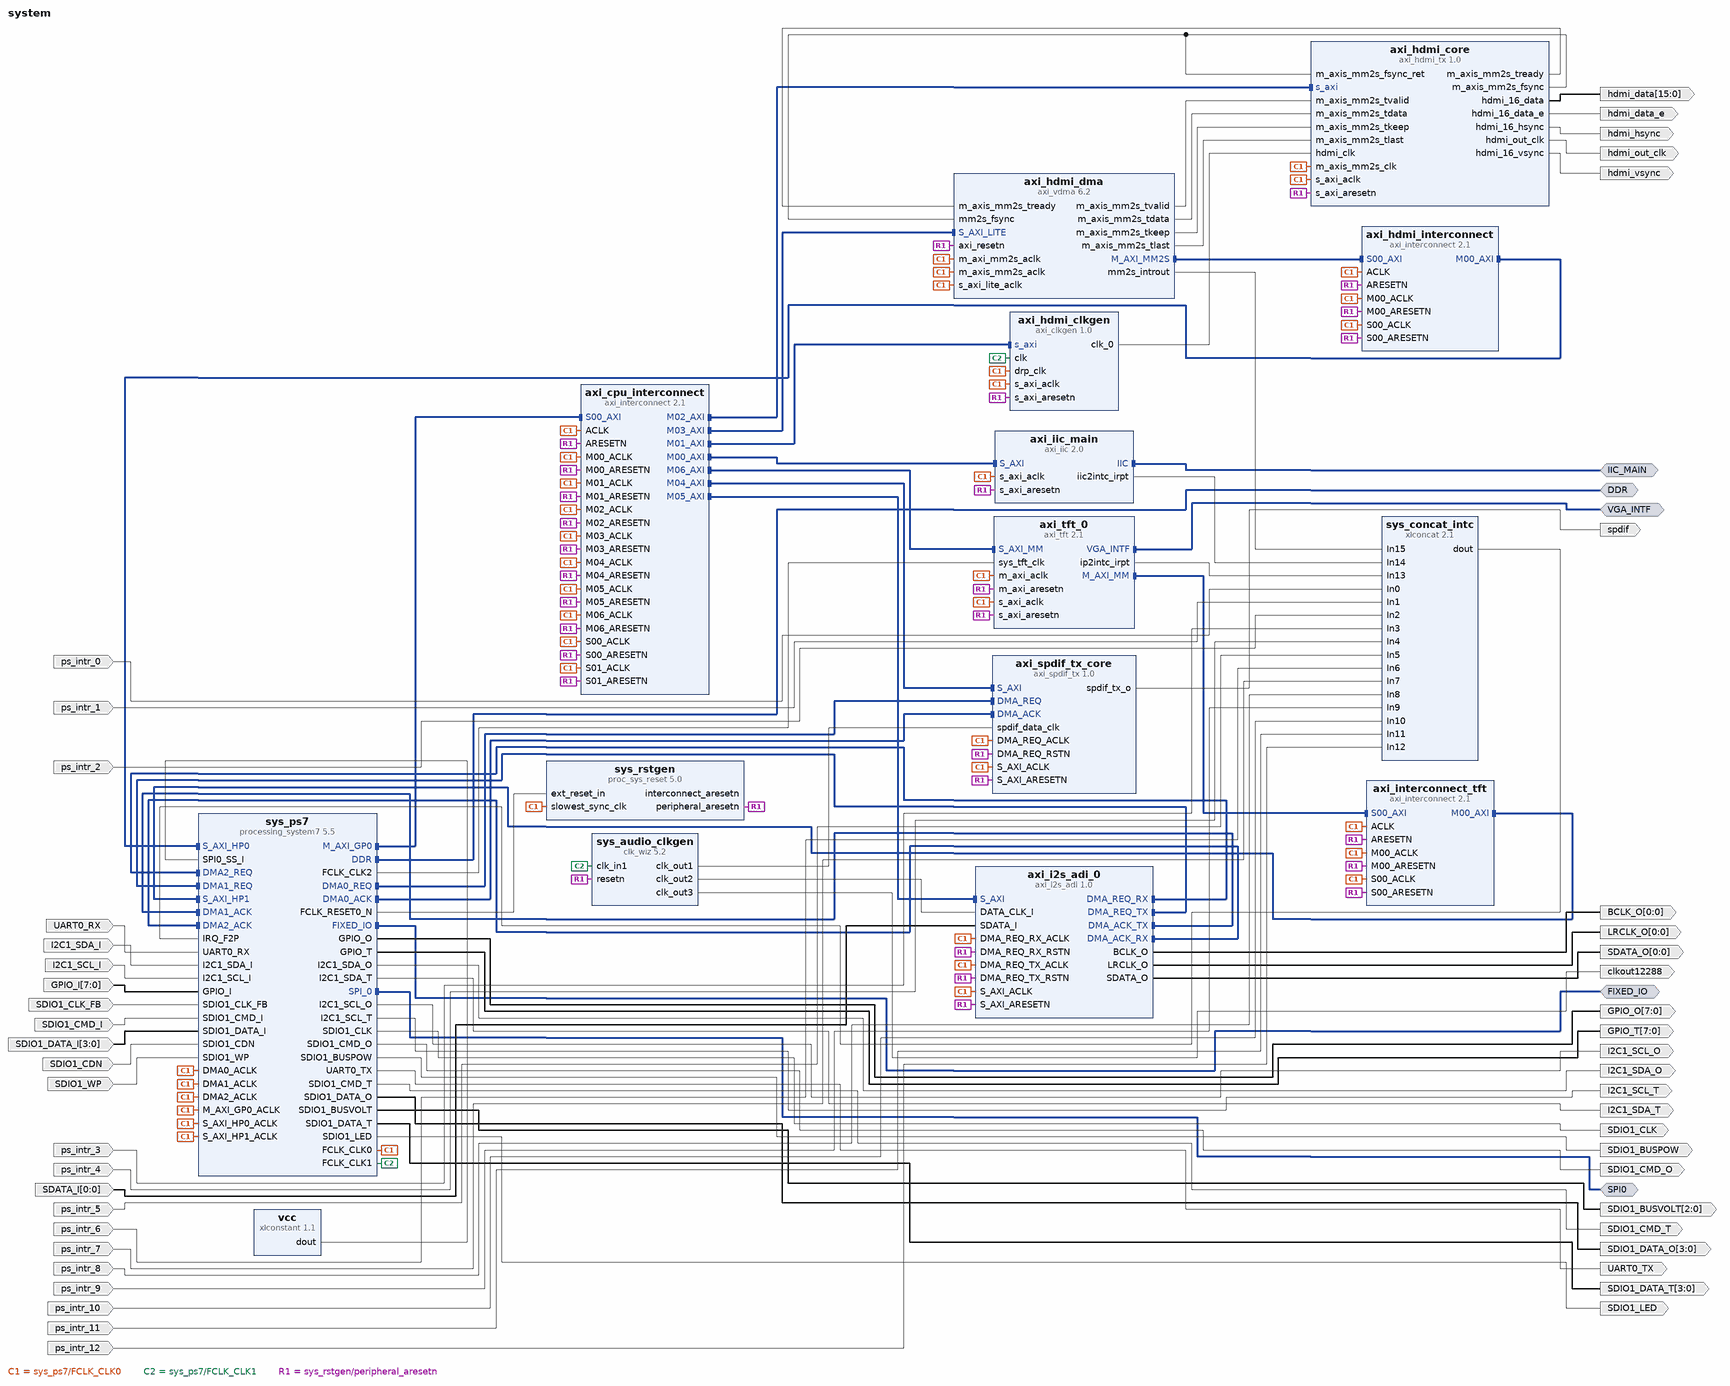
[diagram p0: block diagram of the top level]
# Vivado block design system, Vivado 2015.4
create_bd_design system

create_bd_intf_port -mode Master -vlnv xilinx.com:interface:ddrx_rtl:1.0 DDR
create_bd_intf_port -mode Master -vlnv xilinx.com:display_processing_system7:fixedio_rtl:1.0 FIXED_IO
create_bd_intf_port -mode Master -vlnv xilinx.com:interface:iic_rtl:1.0 IIC_MAIN
create_bd_intf_port -mode Master -vlnv xilinx.com:interface:spi_rtl:1.0 SPI0
create_bd_intf_port -mode Master -vlnv xilinx.com:interface:vga_rtl:1.0 VGA_INTF
create_bd_port -dir O -from 7 -to 0 GPIO_O
create_bd_port -dir O -from 7 -to 0 GPIO_T
create_bd_port -dir O hdmi_out_clk
create_bd_port -dir O hdmi_hsync
create_bd_port -dir O hdmi_vsync
create_bd_port -dir O hdmi_data_e
create_bd_port -dir O -from 15 -to 0 hdmi_data
create_bd_port -dir O spdif
create_bd_port -dir I ps_intr_0
create_bd_port -dir I ps_intr_1
create_bd_port -dir I ps_intr_2
create_bd_port -dir I ps_intr_3
create_bd_port -dir I ps_intr_4
create_bd_port -dir I ps_intr_5
create_bd_port -dir I ps_intr_6
create_bd_port -dir I ps_intr_7
create_bd_port -dir I ps_intr_8
create_bd_port -dir I ps_intr_9
create_bd_port -dir I ps_intr_10
create_bd_port -dir I ps_intr_11
create_bd_port -dir I ps_intr_12
create_bd_port -dir O -from 0 -to 0 SDATA_O
create_bd_port -dir O -from 0 -to 0 LRCLK_O
create_bd_port -dir O -from 0 -to 0 BCLK_O
create_bd_port -dir O UART0_TX
create_bd_port -dir I UART0_RX
create_bd_port -dir I I2C1_SDA_I
create_bd_port -dir O I2C1_SDA_O
create_bd_port -dir O I2C1_SDA_T
create_bd_port -dir I I2C1_SCL_I
create_bd_port -dir O I2C1_SCL_O
create_bd_port -dir O I2C1_SCL_T
create_bd_port -dir O -type clk clkout12288
create_bd_port -dir I -from 7 -to 0 GPIO_I
create_bd_port -dir I -from 0 -to 0 SDATA_I
create_bd_port -dir O SDIO1_CLK
create_bd_port -dir I SDIO1_CLK_FB
create_bd_port -dir O SDIO1_CMD_O
create_bd_port -dir I SDIO1_CMD_I
create_bd_port -dir O SDIO1_CMD_T
create_bd_port -dir I -from 3 -to 0 SDIO1_DATA_I
create_bd_port -dir O -from 3 -to 0 SDIO1_DATA_O
create_bd_port -dir O -from 3 -to 0 SDIO1_DATA_T
create_bd_port -dir I SDIO1_CDN
create_bd_port -dir I SDIO1_WP
create_bd_port -dir O SDIO1_BUSPOW
create_bd_port -dir O -from 2 -to 0 SDIO1_BUSVOLT
create_bd_port -dir O SDIO1_LED

create_bd_cell -type ip -vlnv analog.com:user:axi_clkgen:1.0 axi_hdmi_clkgen
create_bd_cell -type ip -vlnv analog.com:user:axi_hdmi_tx:1.0 axi_hdmi_core
create_bd_cell -type ip -vlnv analog.com:user:axi_spdif_tx:1.0 axi_spdif_tx_core
set_property -dict {CONFIG.C_S_AXI_ADDR_WIDTH 16 CONFIG.C_DMA_TYPE 1} [get_bd_cells axi_spdif_tx_core]
create_bd_cell -type ip -vlnv analog.com:user:axi_i2s_adi:1.0 axi_i2s_adi_0
set_property -dict {CONFIG.C_DMA_TYPE 1} [get_bd_cells axi_i2s_adi_0]
create_bd_cell -type ip -vlnv xilinx.com:ip:xlconcat:2.1 sys_concat_intc
set_property -dict {CONFIG.NUM_PORTS 16} [get_bd_cells sys_concat_intc]
create_bd_cell -type ip -vlnv xilinx.com:ip:processing_system7:5.5 sys_ps7
set_property -dict [list \
  CONFIG.PCW_FPGA0_PERIPHERAL_FREQMHZ 100.0 \
  CONFIG.PCW_FPGA1_PERIPHERAL_FREQMHZ 200.0 \
  CONFIG.PCW_FPGA2_PERIPHERAL_FREQMHZ 30 \
  CONFIG.PCW_USE_S_AXI_HP0 1 \
  CONFIG.PCW_USE_S_AXI_HP1 1 \
  CONFIG.PCW_USE_DMA0 1 \
  CONFIG.PCW_USE_DMA1 1 \
  CONFIG.PCW_USE_DMA2 1 \
  CONFIG.PCW_USE_FABRIC_INTERRUPT 1 \
  CONFIG.PCW_UART0_BAUD_RATE 9600 \
  CONFIG.PCW_EN_CLK1_PORT 1 \
  CONFIG.PCW_EN_CLK2_PORT 1 \
  CONFIG.PCW_IRQ_F2P_INTR 1 \
  CONFIG.PCW_IMPORT_BOARD_PRESET ZC702 \
  CONFIG.PCW_QSPI_GRP_SINGLE_SS_ENABLE 1 \
  CONFIG.PCW_ENET0_PERIPHERAL_ENABLE 1 \
  CONFIG.PCW_ENET0_ENET0_IO {MIO 16 .. 27} \
  CONFIG.PCW_ENET0_GRP_MDIO_ENABLE 1 \
  CONFIG.PCW_SD1_PERIPHERAL_ENABLE 1 \
  CONFIG.PCW_UART0_PERIPHERAL_ENABLE 1 \
  CONFIG.PCW_SPI0_PERIPHERAL_ENABLE 1 \
  CONFIG.PCW_I2C1_PERIPHERAL_ENABLE 1 \
  CONFIG.PCW_GPIO_EMIO_GPIO_ENABLE 1 \
  CONFIG.PCW_GPIO_EMIO_GPIO_IO 8 \
] [get_bd_cells sys_ps7]
# 3 more settings of sys_ps7 are not shown: defaults, MIO pin electricals, DDR timing, and values the tool derives
create_bd_cell -type ip -vlnv xilinx.com:ip:proc_sys_reset:5.0 sys_rstgen
set_property -dict {CONFIG.C_EXT_RST_WIDTH 1} [get_bd_cells sys_rstgen]
create_bd_cell -type ip -vlnv xilinx.com:ip:xlconstant:1.1 vcc
create_bd_cell -type ip -vlnv xilinx.com:ip:axi_interconnect:2.1 axi_cpu_interconnect
set_property -dict {CONFIG.NUM_SI 2 CONFIG.NUM_MI 7 CONFIG.STRATEGY 1} [get_bd_cells axi_cpu_interconnect]
create_bd_cell -type ip -vlnv xilinx.com:ip:axi_vdma:6.2 axi_hdmi_dma
set_property -dict [list \
  CONFIG.c_m_axis_mm2s_tdata_width 64 \
  CONFIG.c_use_mm2s_fsync 1 \
  CONFIG.c_include_s2mm 0 \
] [get_bd_cells axi_hdmi_dma]
create_bd_cell -type ip -vlnv xilinx.com:ip:axi_interconnect:2.1 axi_hdmi_interconnect
set_property -dict {CONFIG.NUM_SI 1 CONFIG.NUM_MI 1} [get_bd_cells axi_hdmi_interconnect]
create_bd_cell -type ip -vlnv xilinx.com:ip:axi_iic:2.0 axi_iic_main
set_property -dict {CONFIG.USE_BOARD_FLOW true CONFIG.IIC_BOARD_INTERFACE iic_main} [get_bd_cells axi_iic_main]
create_bd_cell -type ip -vlnv xilinx.com:ip:clk_wiz:5.2 sys_audio_clkgen
set_property -dict [list \
  CONFIG.PRIM_IN_FREQ 200.000 \
  CONFIG.CLKOUT2_USED true \
  CONFIG.CLKOUT3_USED true \
  CONFIG.NUM_OUT_CLKS 3 \
  CONFIG.CLKOUT1_REQUESTED_OUT_FREQ 12.288 \
  CONFIG.CLKOUT2_REQUESTED_OUT_FREQ 12.288 \
  CONFIG.CLKOUT3_REQUESTED_OUT_FREQ 12.288 \
  CONFIG.USE_LOCKED false \
  CONFIG.USE_RESET true \
  CONFIG.RESET_TYPE ACTIVE_LOW \
  CONFIG.CLKOUT1_JITTER 754.054 \
  CONFIG.CLKOUT1_PHASE_ERROR 802.625 \
  CONFIG.CLKOUT2_JITTER 754.054 \
  CONFIG.CLKOUT2_PHASE_ERROR 802.625 \
  CONFIG.CLKOUT3_JITTER 754.054 \
  CONFIG.CLKOUT3_PHASE_ERROR 802.625 \
] [get_bd_cells sys_audio_clkgen]
create_bd_cell -type ip -vlnv xilinx.com:ip:axi_interconnect:2.1 axi_interconnect_tft
set_property -dict {CONFIG.NUM_MI 1} [get_bd_cells axi_interconnect_tft]
create_bd_cell -type ip -vlnv xilinx.com:ip:axi_tft:2.1 axi_tft_0
set_property -dict [list \
  CONFIG.C_MAX_BURST_LEN 256 \
  CONFIG.C_M_AXI_DATA_WIDTH 64 \
  CONFIG.C_DEFAULT_TFT_BASE_ADDR 0x000000003F200000 \
] [get_bd_cells axi_tft_0]

# ---- connections ----

connect_bd_intf_net [get_bd_intf_pins axi_cpu_interconnect/S00_AXI] [get_bd_intf_pins sys_ps7/M_AXI_GP0]
connect_bd_intf_net [get_bd_intf_pins axi_cpu_interconnect/M00_AXI] [get_bd_intf_pins axi_iic_main/S_AXI]
connect_bd_intf_net [get_bd_intf_pins axi_cpu_interconnect/M01_AXI] [get_bd_intf_pins axi_hdmi_clkgen/s_axi]
connect_bd_intf_net [get_bd_intf_pins axi_cpu_interconnect/M02_AXI] [get_bd_intf_pins axi_hdmi_core/s_axi]
connect_bd_intf_net [get_bd_intf_pins axi_cpu_interconnect/M03_AXI] [get_bd_intf_pins axi_hdmi_dma/S_AXI_LITE]
connect_bd_intf_net [get_bd_intf_pins axi_hdmi_interconnect/S00_AXI] [get_bd_intf_pins axi_hdmi_dma/M_AXI_MM2S]
connect_bd_intf_net [get_bd_intf_pins axi_hdmi_interconnect/M00_AXI] [get_bd_intf_pins sys_ps7/S_AXI_HP0]
connect_bd_intf_net [get_bd_intf_pins axi_cpu_interconnect/M04_AXI] [get_bd_intf_pins axi_spdif_tx_core/S_AXI]
connect_bd_intf_net -intf_net axi_spdif_dma_req_tx [get_bd_intf_pins sys_ps7/DMA0_REQ] [get_bd_intf_pins axi_spdif_tx_core/DMA_REQ]
connect_bd_intf_net -intf_net axi_spdif_dma_ack_tx [get_bd_intf_pins sys_ps7/DMA0_ACK] [get_bd_intf_pins axi_spdif_tx_core/DMA_ACK]
connect_bd_intf_net [get_bd_intf_pins axi_cpu_interconnect/M05_AXI] [get_bd_intf_pins axi_i2s_adi_0/S_AXI]
connect_bd_intf_net [get_bd_intf_pins axi_i2s_adi_0/DMA_REQ_RX] [get_bd_intf_pins sys_ps7/DMA2_REQ]
connect_bd_intf_net [get_bd_intf_pins axi_i2s_adi_0/DMA_REQ_TX] [get_bd_intf_pins sys_ps7/DMA1_REQ]
connect_bd_intf_net [get_bd_intf_pins axi_i2s_adi_0/DMA_ACK_TX] [get_bd_intf_pins sys_ps7/DMA1_ACK]
connect_bd_intf_net [get_bd_intf_pins axi_i2s_adi_0/DMA_ACK_RX] [get_bd_intf_pins sys_ps7/DMA2_ACK]
connect_bd_intf_net [get_bd_intf_pins axi_tft_0/M_AXI_MM] [get_bd_intf_pins axi_interconnect_tft/S00_AXI]
connect_bd_intf_net [get_bd_intf_pins sys_ps7/S_AXI_HP1] [get_bd_intf_pins axi_interconnect_tft/M00_AXI]
connect_bd_intf_net [get_bd_intf_pins axi_cpu_interconnect/M06_AXI] [get_bd_intf_pins axi_tft_0/S_AXI_MM]
connect_bd_intf_net [get_bd_intf_ports DDR] [get_bd_intf_pins sys_ps7/DDR]
connect_bd_intf_net [get_bd_intf_ports FIXED_IO] [get_bd_intf_pins sys_ps7/FIXED_IO]
connect_bd_intf_net [get_bd_intf_ports IIC_MAIN] [get_bd_intf_pins axi_iic_main/IIC]
connect_bd_intf_net [get_bd_intf_ports SPI0] [get_bd_intf_pins sys_ps7/SPI_0]
connect_bd_intf_net [get_bd_intf_ports VGA_INTF] [get_bd_intf_pins axi_tft_0/VGA_INTF]
connect_bd_net -net sys_100m_clk [get_bd_pins sys_ps7/FCLK_CLK0] \
  [get_bd_pins axi_hdmi_clkgen/s_axi_aclk] [get_bd_pins axi_hdmi_clkgen/drp_clk] [get_bd_pins axi_hdmi_core/s_axi_aclk] \
  [get_bd_pins axi_hdmi_core/m_axis_mm2s_clk] [get_bd_pins axi_spdif_tx_core/S_AXI_ACLK] \
  [get_bd_pins axi_spdif_tx_core/DMA_REQ_ACLK] [get_bd_pins axi_i2s_adi_0/DMA_REQ_TX_ACLK] \
  [get_bd_pins axi_i2s_adi_0/DMA_REQ_RX_ACLK] [get_bd_pins axi_i2s_adi_0/S_AXI_ACLK] [get_bd_pins sys_ps7/M_AXI_GP0_ACLK] \
  [get_bd_pins sys_ps7/S_AXI_HP0_ACLK] [get_bd_pins sys_ps7/DMA0_ACLK] [get_bd_pins sys_ps7/DMA1_ACLK] \
  [get_bd_pins sys_ps7/DMA2_ACLK] [get_bd_pins sys_rstgen/slowest_sync_clk] [get_bd_pins axi_hdmi_dma/s_axi_lite_aclk] \
  [get_bd_pins axi_hdmi_dma/m_axi_mm2s_aclk] [get_bd_pins axi_hdmi_dma/m_axis_mm2s_aclk] \
  [get_bd_pins axi_iic_main/s_axi_aclk] [get_bd_pins sys_ps7/S_AXI_HP1_ACLK] [get_bd_pins axi_cpu_interconnect/ACLK] \
  [get_bd_pins axi_cpu_interconnect/S00_ACLK] [get_bd_pins axi_cpu_interconnect/M00_ACLK] \
  [get_bd_pins axi_cpu_interconnect/M01_ACLK] [get_bd_pins axi_cpu_interconnect/M02_ACLK] \
  [get_bd_pins axi_cpu_interconnect/M03_ACLK] [get_bd_pins axi_cpu_interconnect/M04_ACLK] \
  [get_bd_pins axi_cpu_interconnect/M05_ACLK] [get_bd_pins axi_hdmi_interconnect/ACLK] \
  [get_bd_pins axi_hdmi_interconnect/S00_ACLK] [get_bd_pins axi_hdmi_interconnect/M00_ACLK] \
  [get_bd_pins axi_cpu_interconnect/M06_ACLK] [get_bd_pins axi_cpu_interconnect/S01_ACLK] \
  [get_bd_pins axi_interconnect_tft/ACLK] [get_bd_pins axi_interconnect_tft/S00_ACLK] \
  [get_bd_pins axi_interconnect_tft/M00_ACLK] [get_bd_pins axi_tft_0/s_axi_aclk] [get_bd_pins axi_tft_0/m_axi_aclk]
connect_bd_net -net sys_200m_clk [get_bd_pins sys_ps7/FCLK_CLK1] [get_bd_pins axi_hdmi_clkgen/clk] [get_bd_pins sys_audio_clkgen/clk_in1]
connect_bd_net -net sys_aux_reset [get_bd_pins sys_ps7/FCLK_RESET0_N] [get_bd_pins sys_rstgen/ext_reset_in]
connect_bd_net -net sys_100m_resetn [get_bd_pins sys_rstgen/peripheral_aresetn] \
  [get_bd_pins axi_hdmi_clkgen/s_axi_aresetn] [get_bd_pins axi_hdmi_core/s_axi_aresetn] \
  [get_bd_pins axi_spdif_tx_core/S_AXI_ARESETN] [get_bd_pins axi_spdif_tx_core/DMA_REQ_RSTN] \
  [get_bd_pins axi_i2s_adi_0/S_AXI_ARESETN] [get_bd_pins axi_i2s_adi_0/DMA_REQ_TX_RSTN] \
  [get_bd_pins axi_i2s_adi_0/DMA_REQ_RX_RSTN] [get_bd_pins axi_hdmi_dma/axi_resetn] [get_bd_pins axi_iic_main/s_axi_aresetn] \
  [get_bd_pins sys_audio_clkgen/resetn] [get_bd_pins axi_cpu_interconnect/ARESETN] \
  [get_bd_pins axi_cpu_interconnect/S00_ARESETN] [get_bd_pins axi_cpu_interconnect/M00_ARESETN] \
  [get_bd_pins axi_cpu_interconnect/M01_ARESETN] [get_bd_pins axi_cpu_interconnect/M02_ARESETN] \
  [get_bd_pins axi_cpu_interconnect/M03_ARESETN] [get_bd_pins axi_cpu_interconnect/M04_ARESETN] \
  [get_bd_pins axi_cpu_interconnect/M05_ARESETN] [get_bd_pins axi_hdmi_interconnect/ARESETN] \
  [get_bd_pins axi_hdmi_interconnect/S00_ARESETN] [get_bd_pins axi_hdmi_interconnect/M00_ARESETN] \
  [get_bd_pins axi_cpu_interconnect/M06_ARESETN] [get_bd_pins axi_cpu_interconnect/S01_ARESETN] \
  [get_bd_pins axi_interconnect_tft/ARESETN] [get_bd_pins axi_interconnect_tft/S00_ARESETN] \
  [get_bd_pins axi_interconnect_tft/M00_ARESETN] [get_bd_pins axi_tft_0/s_axi_aresetn] [get_bd_pins axi_tft_0/m_axi_aresetn]
# net sys_200m_resetn has one end: sys_rstgen/interconnect_aresetn
connect_bd_net [get_bd_pins sys_ps7/GPIO_O] [get_bd_ports GPIO_O]
connect_bd_net [get_bd_pins sys_ps7/GPIO_T] [get_bd_ports GPIO_T]
connect_bd_net -net axi_hdmi_tx_core_hdmi_clk [get_bd_pins axi_hdmi_clkgen/clk_0] [get_bd_pins axi_hdmi_core/hdmi_clk]
connect_bd_net -net axi_hdmi_tx_core_hdmi_out_clk [get_bd_pins axi_hdmi_core/hdmi_out_clk] [get_bd_ports hdmi_out_clk]
connect_bd_net -net axi_hdmi_tx_core_hdmi_hsync [get_bd_pins axi_hdmi_core/hdmi_16_hsync] [get_bd_ports hdmi_hsync]
connect_bd_net -net axi_hdmi_tx_core_hdmi_vsync [get_bd_pins axi_hdmi_core/hdmi_16_vsync] [get_bd_ports hdmi_vsync]
connect_bd_net -net axi_hdmi_tx_core_hdmi_data_e [get_bd_pins axi_hdmi_core/hdmi_16_data_e] [get_bd_ports hdmi_data_e]
connect_bd_net -net axi_hdmi_tx_core_hdmi_data [get_bd_pins axi_hdmi_core/hdmi_16_data] [get_bd_ports hdmi_data]
connect_bd_net -net axi_hdmi_tx_core_mm2s_tvalid [get_bd_pins axi_hdmi_dma/m_axis_mm2s_tvalid] [get_bd_pins axi_hdmi_core/m_axis_mm2s_tvalid]
connect_bd_net -net axi_hdmi_tx_core_mm2s_tdata [get_bd_pins axi_hdmi_dma/m_axis_mm2s_tdata] [get_bd_pins axi_hdmi_core/m_axis_mm2s_tdata]
connect_bd_net -net axi_hdmi_tx_core_mm2s_tkeep [get_bd_pins axi_hdmi_dma/m_axis_mm2s_tkeep] [get_bd_pins axi_hdmi_core/m_axis_mm2s_tkeep]
connect_bd_net -net axi_hdmi_tx_core_mm2s_tlast [get_bd_pins axi_hdmi_dma/m_axis_mm2s_tlast] [get_bd_pins axi_hdmi_core/m_axis_mm2s_tlast]
connect_bd_net -net axi_hdmi_tx_core_mm2s_tready [get_bd_pins axi_hdmi_core/m_axis_mm2s_tready] [get_bd_pins axi_hdmi_dma/m_axis_mm2s_tready]
connect_bd_net -net axi_hdmi_tx_core_mm2s_fsync [get_bd_pins axi_hdmi_core/m_axis_mm2s_fsync] \
  [get_bd_pins axi_hdmi_core/m_axis_mm2s_fsync_ret] [get_bd_pins axi_hdmi_dma/mm2s_fsync]
connect_bd_net -net sys_audio_clkgen_clk [get_bd_pins sys_audio_clkgen/clk_out1] [get_bd_pins axi_spdif_tx_core/spdif_data_clk]
connect_bd_net -net spdif_s [get_bd_pins axi_spdif_tx_core/spdif_tx_o] [get_bd_ports spdif]
connect_bd_net [get_bd_pins sys_concat_intc/dout] [get_bd_pins sys_ps7/IRQ_F2P]
connect_bd_net [get_bd_pins axi_hdmi_dma/mm2s_introut] [get_bd_pins sys_concat_intc/In15]
connect_bd_net [get_bd_pins axi_iic_main/iic2intc_irpt] [get_bd_pins sys_concat_intc/In14]
connect_bd_net -net ps_intr_0_1 [get_bd_ports ps_intr_0] [get_bd_pins sys_concat_intc/In0]
connect_bd_net -net ps_intr_1_1 [get_bd_ports ps_intr_1] [get_bd_pins sys_concat_intc/In1]
connect_bd_net -net ps_intr_2_1 [get_bd_ports ps_intr_2] [get_bd_pins sys_concat_intc/In2]
connect_bd_net -net ps_intr_3_1 [get_bd_ports ps_intr_3] [get_bd_pins sys_concat_intc/In3]
connect_bd_net -net ps_intr_4_1 [get_bd_ports ps_intr_4] [get_bd_pins sys_concat_intc/In4]
connect_bd_net -net ps_intr_5_1 [get_bd_ports ps_intr_5] [get_bd_pins sys_concat_intc/In5]
connect_bd_net -net ps_intr_6_1 [get_bd_ports ps_intr_6] [get_bd_pins sys_concat_intc/In6]
connect_bd_net -net ps_intr_7_1 [get_bd_ports ps_intr_7] [get_bd_pins sys_concat_intc/In7]
connect_bd_net -net ps_intr_8_1 [get_bd_ports ps_intr_8] [get_bd_pins sys_concat_intc/In8]
connect_bd_net -net ps_intr_9_1 [get_bd_ports ps_intr_9] [get_bd_pins sys_concat_intc/In9]
connect_bd_net -net ps_intr_10_1 [get_bd_ports ps_intr_10] [get_bd_pins sys_concat_intc/In10]
connect_bd_net -net ps_intr_11_1 [get_bd_ports ps_intr_11] [get_bd_pins sys_concat_intc/In11]
connect_bd_net -net ps_intr_12_1 [get_bd_ports ps_intr_12] [get_bd_pins sys_concat_intc/In12]
connect_bd_net [get_bd_pins sys_audio_clkgen/clk_out2] [get_bd_pins axi_i2s_adi_0/DATA_CLK_I]
connect_bd_net [get_bd_pins axi_i2s_adi_0/SDATA_O] [get_bd_ports SDATA_O]
connect_bd_net [get_bd_pins axi_i2s_adi_0/LRCLK_O] [get_bd_ports LRCLK_O]
connect_bd_net [get_bd_pins axi_i2s_adi_0/BCLK_O] [get_bd_ports BCLK_O]
connect_bd_net [get_bd_pins sys_ps7/UART0_TX] [get_bd_ports UART0_TX]
connect_bd_net [get_bd_ports UART0_RX] [get_bd_pins sys_ps7/UART0_RX]
connect_bd_net [get_bd_ports I2C1_SDA_I] [get_bd_pins sys_ps7/I2C1_SDA_I]
connect_bd_net [get_bd_pins sys_ps7/I2C1_SDA_O] [get_bd_ports I2C1_SDA_O]
connect_bd_net [get_bd_pins sys_ps7/I2C1_SDA_T] [get_bd_ports I2C1_SDA_T]
connect_bd_net [get_bd_ports I2C1_SCL_I] [get_bd_pins sys_ps7/I2C1_SCL_I]
connect_bd_net [get_bd_pins sys_ps7/I2C1_SCL_O] [get_bd_ports I2C1_SCL_O]
connect_bd_net [get_bd_pins sys_ps7/I2C1_SCL_T] [get_bd_ports I2C1_SCL_T]
connect_bd_net [get_bd_pins sys_audio_clkgen/clk_out3] [get_bd_ports clkout12288]
connect_bd_net [get_bd_ports GPIO_I] [get_bd_pins sys_ps7/GPIO_I]
connect_bd_net [get_bd_ports SDATA_I] [get_bd_pins axi_i2s_adi_0/SDATA_I]
connect_bd_net [get_bd_pins vcc/dout] [get_bd_pins sys_ps7/SPI0_SS_I]
connect_bd_net [get_bd_pins sys_ps7/FCLK_CLK2] [get_bd_pins axi_tft_0/sys_tft_clk]
connect_bd_net [get_bd_pins axi_tft_0/ip2intc_irpt] [get_bd_pins sys_concat_intc/In13]
connect_bd_net [get_bd_pins sys_ps7/SDIO1_CLK] [get_bd_ports SDIO1_CLK]
connect_bd_net [get_bd_ports SDIO1_CLK_FB] [get_bd_pins sys_ps7/SDIO1_CLK_FB]
connect_bd_net [get_bd_pins sys_ps7/SDIO1_CMD_O] [get_bd_ports SDIO1_CMD_O]
connect_bd_net [get_bd_ports SDIO1_CMD_I] [get_bd_pins sys_ps7/SDIO1_CMD_I]
connect_bd_net [get_bd_pins sys_ps7/SDIO1_CMD_T] [get_bd_ports SDIO1_CMD_T]
connect_bd_net [get_bd_ports SDIO1_DATA_I] [get_bd_pins sys_ps7/SDIO1_DATA_I]
connect_bd_net [get_bd_pins sys_ps7/SDIO1_DATA_O] [get_bd_ports SDIO1_DATA_O]
connect_bd_net [get_bd_pins sys_ps7/SDIO1_DATA_T] [get_bd_ports SDIO1_DATA_T]
connect_bd_net [get_bd_ports SDIO1_CDN] [get_bd_pins sys_ps7/SDIO1_CDN]
connect_bd_net [get_bd_ports SDIO1_WP] [get_bd_pins sys_ps7/SDIO1_WP]
connect_bd_net [get_bd_pins sys_ps7/SDIO1_BUSPOW] [get_bd_ports SDIO1_BUSPOW]
connect_bd_net [get_bd_pins sys_ps7/SDIO1_BUSVOLT] [get_bd_ports SDIO1_BUSVOLT]
connect_bd_net [get_bd_pins sys_ps7/SDIO1_LED] [get_bd_ports SDIO1_LED]

# ---- address map ----
assign_bd_address -offset 0x00000000 -range 1G -target_address_space [get_bd_addr_spaces axi_hdmi_dma/Data_MM2S] [get_bd_addr_segs sys_ps7/S_AXI_HP0/HP0_DDR_LOWOCM]
assign_bd_address -offset 0x00000000 -range 1G -target_address_space [get_bd_addr_spaces axi_tft_0/Video_data] [get_bd_addr_segs sys_ps7/S_AXI_HP1/HP1_DDR_LOWOCM]
assign_bd_address -offset 0x41600000 -range 64K -target_address_space [get_bd_addr_spaces sys_ps7/Data] [get_bd_addr_segs axi_iic_main/S_AXI/Reg]
assign_bd_address -offset 0x43000000 -range 64K -target_address_space [get_bd_addr_spaces sys_ps7/Data] [get_bd_addr_segs axi_hdmi_dma/S_AXI_LITE/Reg]
assign_bd_address -offset 0x43C00000 -range 64K -target_address_space [get_bd_addr_spaces sys_ps7/Data] [get_bd_addr_segs axi_tft_0/S_AXI_MM/Reg]
assign_bd_address -offset 0x70E00000 -range 64K -target_address_space [get_bd_addr_spaces sys_ps7/Data] [get_bd_addr_segs axi_hdmi_core/s_axi/axi_lite]
assign_bd_address -offset 0x75C00000 -range 64K -target_address_space [get_bd_addr_spaces sys_ps7/Data] [get_bd_addr_segs axi_spdif_tx_core/S_AXI/reg0]
assign_bd_address -offset 0x77600000 -range 64K -target_address_space [get_bd_addr_spaces sys_ps7/Data] [get_bd_addr_segs axi_i2s_adi_0/S_AXI/reg0]
assign_bd_address -offset 0x79000000 -range 64K -target_address_space [get_bd_addr_spaces sys_ps7/Data] [get_bd_addr_segs axi_hdmi_clkgen/s_axi/axi_lite]

validate_bd_design
save_bd_design
